# Altium schematic sheet control.SchDoc
size A3
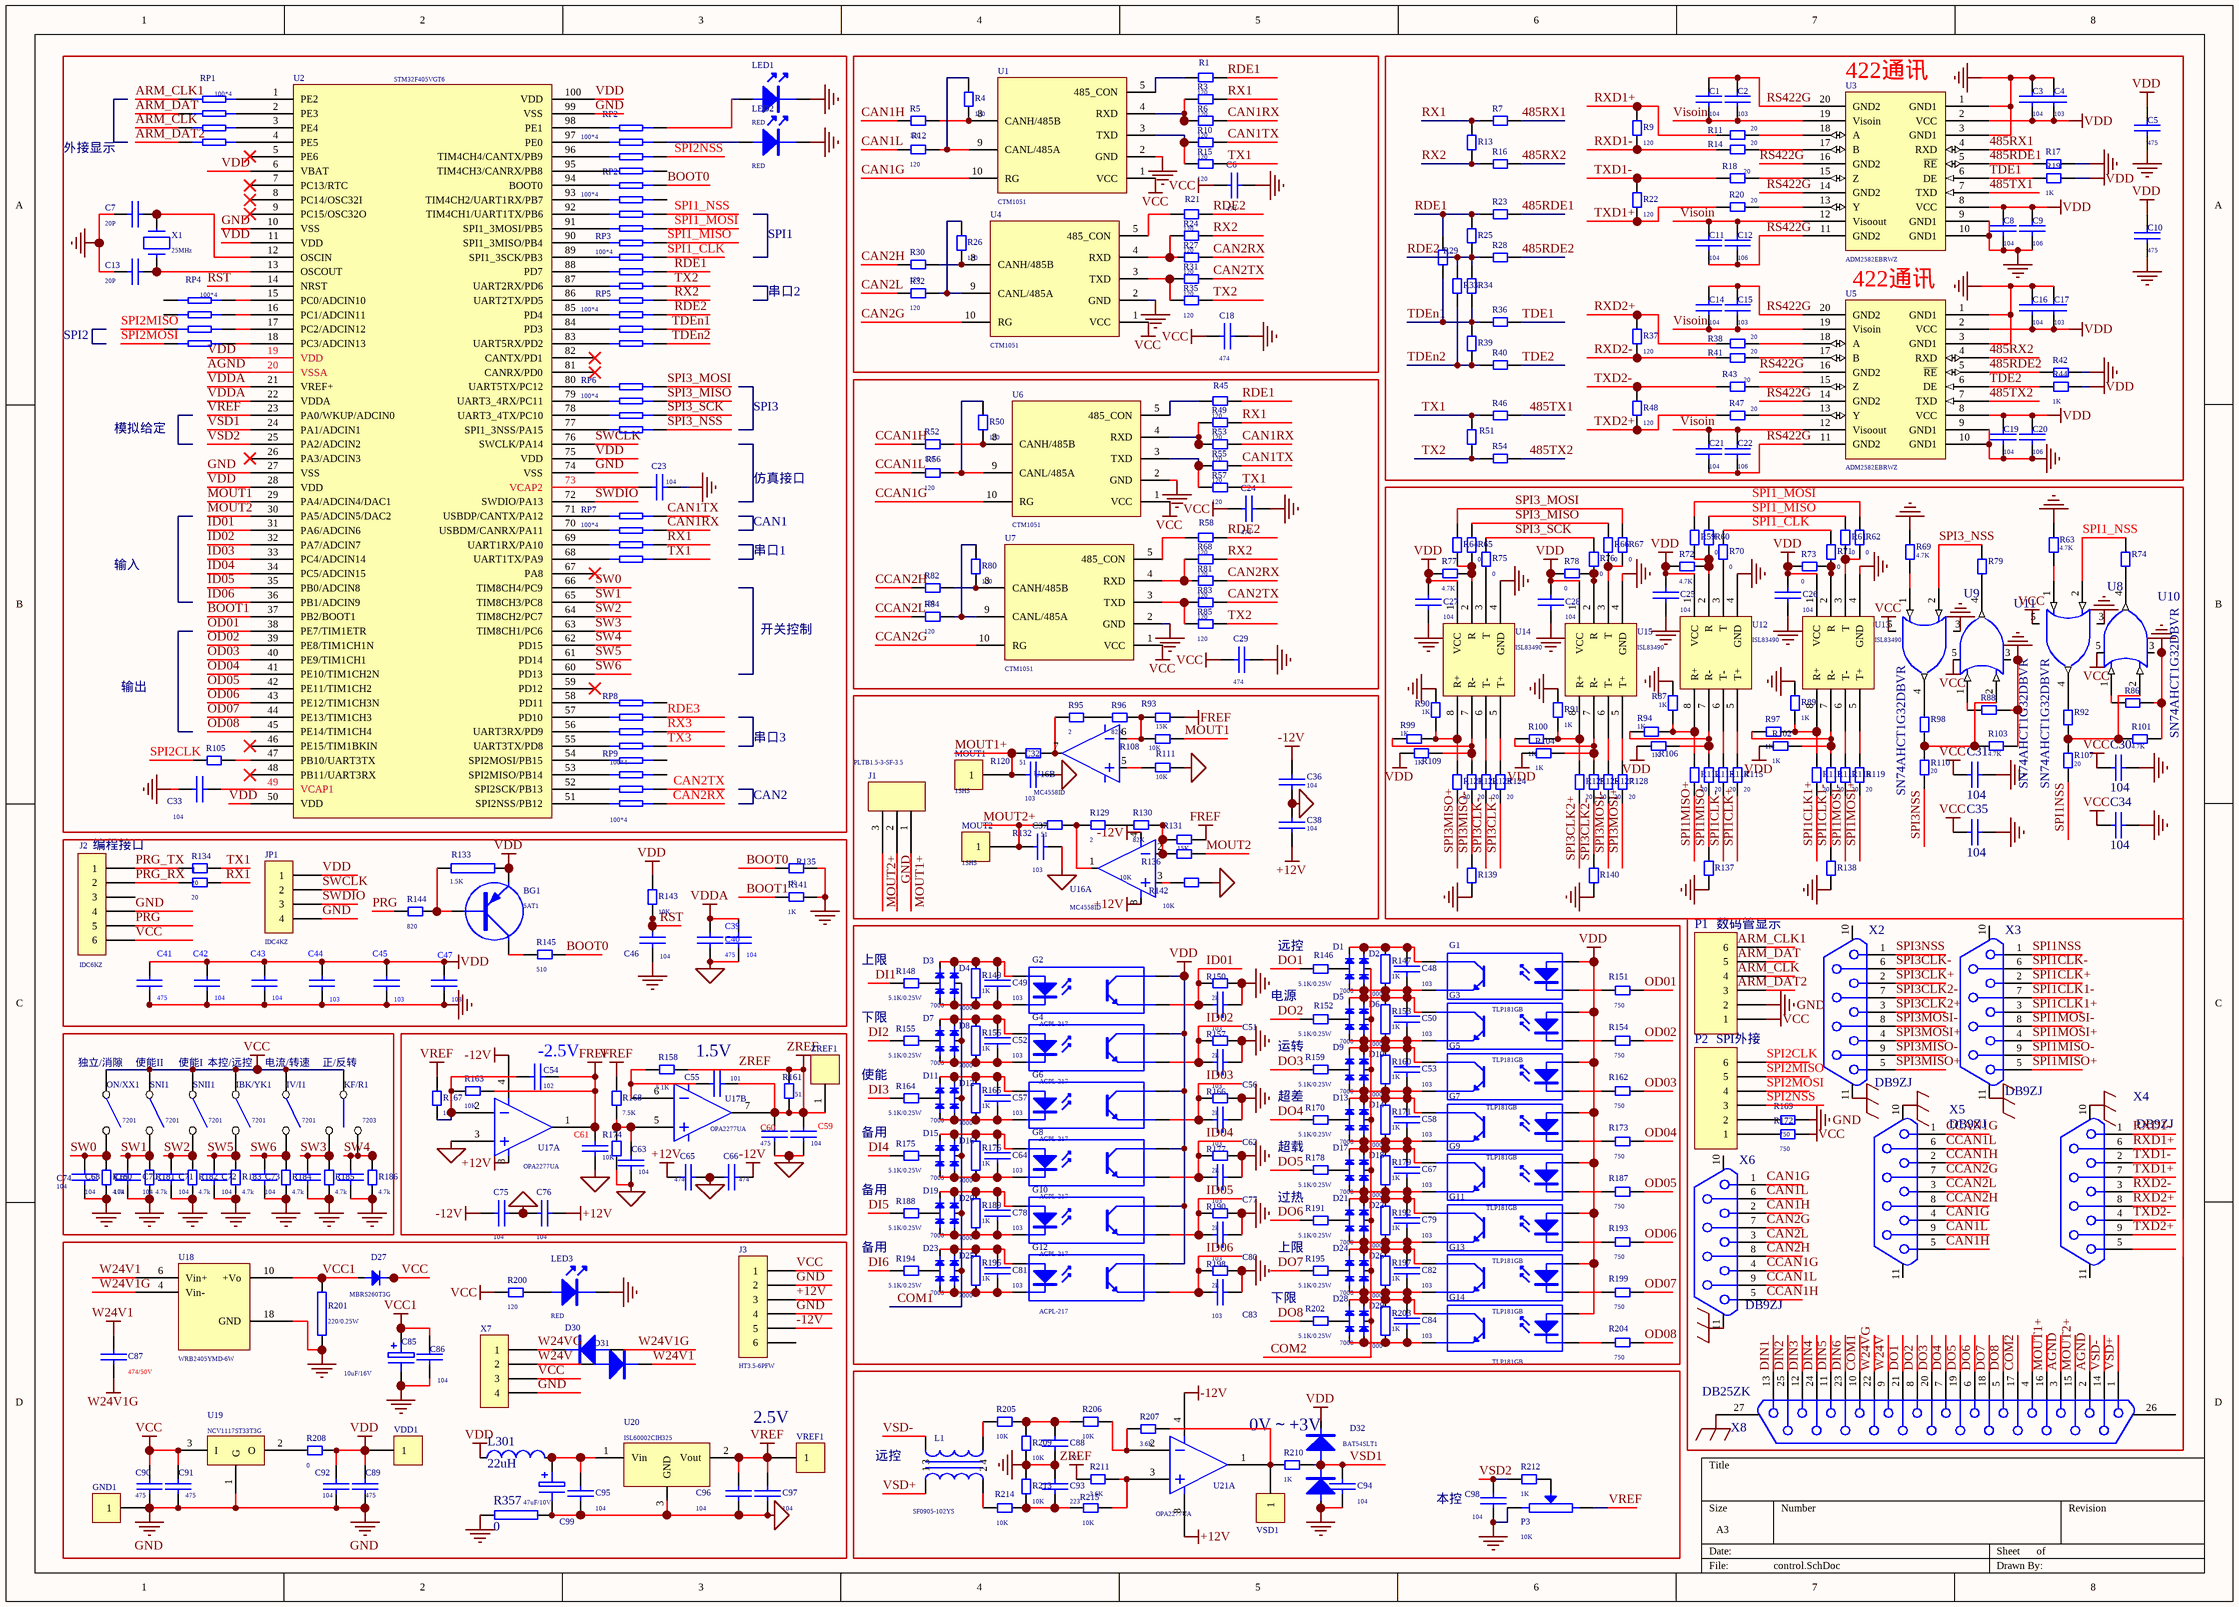
[diagram p0: control.SchDoc]

## Parts
(Parts that share a designator on the sheet are numbered #1, #2 ... from top to bottom, then left to right.)
1  20  [0603S]
BG1  5AT1  [SOT-23NP]
C1  104  [C0603S]
C2  103  [C0603S]
C3  104  [C0603S]
C4  103  [C0603S]
C5  475  [C0805S]
C6  474  [C0603S]
C7  20P  [C0603S]
C8  104  [C0603S]
C9  106  [C0805S]
C10  475  [C0805S]
C11  104  [C0603S]
C12  106  [C0805S]
C13  20P  [C0603S]
C14  104  [C0603S]
C15  103  [C0603S]
C16  104  [C0603S]
C17  103  [C0603S]
C18  474  [C0603S]
C19  104  [C0603S]
C20  106  [C0805S]
C21  104  [C0603S]
C22  106  [C0805S]
C23  104  [C0603S]
C24  474  [C0603S]
C25  104  [C0603]
C26  104  [C0603]
C27  104  [C0603]
C28  104  [C0603]
C29  474  [C0603S]
C30  104  [C0603]
C31  104  [C0603]
C32  103  [C0805]
C33  104  [C0603S]
C34  104  [C0603]
C35  104  [C0603]
C36  104  [C0805]
C37  103  [C0805]
C38  104  [C0805]
C39  104  [C0603S]
C40  475  [C0805S]
C41  475  [C0805S]
C42  104  [C0603S]
C43  104  [C0603S]
C44  103  [C0603S]
C45  103  [C0603S]
C46  104  [C0603S]
C47  103  [C0603S]
C48  103  [C0603S]
C49  103  [C0603S]
C50  103  [C0603S]
C51  103  [C0603S]
C52  103  [C0603S]
C53  103  [C0603S]
C54  102  [C0805]
C55  101  [C0805]
C56  103  [C0603S]
C57  103  [C0603S]
C58  103  [C0603S]
C59  104  [C0805]
C60  475  [C0805]
C61  (no value)  [C0805]
C62  103  [C0603S]
C63  104  [C0805]
C64  103  [C0603S]
C65  474  [C0805]
C66  474  [C0805]
C67  103  [C0603S]
C68  104  [C0805]
C69  104  [C0805]
C70  104  [C0805]
C71  104  [C0805]
C72  104  [C0805]
C73  104  [C0805]
C74  104  [C0805]
C75  104  [C0805]
C76  104  [C0805]
C77  103  [C0603S]
C78  103  [C0603S]
C79  103  [C0603S]
C80  103  [C0603S]
C81  103  [C0603S]
C82  103  [C0603S]
C83  103  [C0603S]
C84  103  [C0603S]
C85  10uF/16V  [3216T]
C86  104  [C0805]
C87  474/50V  [C0805S]
C88  223  [C0805]
C89  475  [C0805]
C90  475  [C0805]
C91  475  [C0805]
C92  104  [C0805]
C93  223  [C0805]
C94  104  [C0805]
C95  104  [C0805]
C96  104  [C0805]
C97  104  [C0805]
C98  104  [C0805]
C99  47uF/10V  [3528T]
D1  7000  [SOT-23]
D2  7000  [SOT-23]
D3  7000  [SOT-23]
D4  7000  [SOT-23]
D5  7000  [SOT-23]
D6  7000  [SOT-23]
D7  7000  [SOT-23]
D8  7000  [SOT-23]
D9  7000  [SOT-23]
D10  7000  [SOT-23]
D11  7000  [SOT-23]
D12  7000  [SOT-23]
D13  7000  [SOT-23]
D14  7000  [SOT-23]
D15  7000  [SOT-23]
D16  7000  [SOT-23]
D17  7000  [SOT-23]
D18  7000  [SOT-23]
D19  7000  [SOT-23]
D20  7000  [SOT-23]
D21  7000  [SOT-23]
D22  7000  [SOT-23]
D23  7000  [SOT-23]
D24  7000  [SOT-23]
D25  7000  [SOT-23]
D26  7000  [SOT-23]
D27  MBRS260T3G  [SMB]
D28  7000  [SOT-23]
D29  7000  [SOT-23]
D30  (no value)  [SMB]
D31  (no value)  [SMB]
D32  BAT54SLT1  [SOT-23]
G1  TLP181GB  [SO-4]
G2  ACPL-217  [SO-4S]
G3  TLP181GB  [SO-4]
G4  ACPL-217  [SO-4S]
G5  TLP181GB  [SO-4]
G6  ACPL-217  [SO-4S]
G7  TLP181GB  [SO-4]
G8  ACPL-217  [SO-4S]
G9  TLP181GB  [SO-4]
G10  ACPL-217  [SO-4S]
G11  TLP181GB  [SO-4]
G12  ACPL-217  [SO-4S]
G13  TLP181GB  [SO-4]
G14  TLP181GB  [SO-4]
GND1  (no value)  [TP]
IBK/YK1  7201  [7201]
IV/I1  7201  [7201]
J1  PLTB1.5-3-SF-3.5  [HT3.5-3PFL]
J2  IDC6KZ  [SIP6]
J3  HT3.5-6PFW  [HT3.5-6PFW]
JP1  IDC4KZ  [IDC4]
KF/R1  7203  [7203]
L1  SF0905-102YS  [SF0905]
L301  22uH  [1230]
LED1  RED  [LED0805]
LED2  RED  [LED0805]
LED3  RED  [LED0805]
MOUT1  1SHS  [CONS]
MOUT2  1SHS  [CONS]
ON/XX1  7201  [7201]
P1  数码管显示  [HDR1X6]
P2  SPI外接  [HDR1X6]
P3  10K  [SOTW19]
R1  120  [0805S]
R3  120  [0805S]
R4  120  [0805S]
R5  120  [0805S]
R6  120  [0805S]
R7  (no value)  [0603S]
R9  120  [0805S]
R10  120  [0805S]
R11  20  [0603S]
R12  120  [0805S]
R13  (no value)  [0603S]
R14  20  [0603S]
R15  120  [0805S]
R16  (no value)  [0603S]
R17  (no value)  [0603S]
R18  20  [0603S]
R19  1K  [0603S]
R20  20  [0603S]
R21  120  [0805S]
R22  120  [0805S]
R23  (no value)  [0603S]
R24  120  [0805S]
R25  (no value)  [0603S]
R26  120  [0805S]
R27  120  [0805S]
R28  (no value)  [0603S]
R29  (no value)  [0603S]
R30  120  [0805S]
R31  120  [0805S]
R32  120  [0805S]
R33  (no value)  [0603S]
R34  (no value)  [0603S]
R35  120  [0805S]
R36  (no value)  [0603S]
R37  120  [0805S]
R38  20  [0603S]
R39  (no value)  [0603S]
R40  (no value)  [0603S]
R41  20  [0603S]
R42  (no value)  [0603S]
R43  20  [0603S]
R44  1K  [0603S]
R45  120  [0805S]
R46  (no value)  [0603S]
R47  20  [0603S]
R48  120  [0805S]
R49  120  [0805S]
R50  120  [0805S]
R51  (no value)  [0603S]
R52  120  [0805S]
R53  120  [0805S]
R54  (no value)  [0603S]
R55  120  [0805S]
R56  120  [0805S]
R57  120  [0805S]
R58  120  [0805S]
R59  (no value)  [0603S]
R60  0  [0603S]
R61  0  [0603S]
R62  0  [0603S]
R63  4.7K  [0603S]
R64  (no value)  [0603S]
R65  0  [0603S]
R66  0  [0603S]
R67  0  [0603S]
R68  120  [0805S]
R69  4.7K  [0603S]
R70  0  [0603S]
R71  0  [0603S]
R72  4.7K  [0603S]
R73  0  [0603S]
R74  (no value)  [0603S]
R75  0  [0603S]
R76  0  [0603S]
R77  4.7K  [0603S]
R78  0  [0603S]
R79  (no value)  [0603S]
R80  120  [0805S]
R81  120  [0805S]
R82  120  [0805S]
R83  120  [0805S]
R84  120  [0805S]
R85  120  [0805S]
R86  (no value)  [0603S]
R87  1K  [0603S]
R88  (no value)  [0603S]
R89  1K  [0603S]
R90  1K  [0603S]
R91  1K  [0603S]
R92  (no value)  [0603S]
R93  15K  [0805S]
R94  1K  [0603S]
R95  2  [0805S]
R96  82K  [0805S]
R97  1K  [0603S]
R98  (no value)  [0603S]
R99  1K  [0603S]
R100  1K  [0603S]
R101  4.7K  [0603S]
R102  1K  [0603S]
R103  4.7K  [0603S]
R104  1K  [0603S]
R105  (no value)  [0603S]
R106  1K  [0603S]
R107  20  [0603S]
R108  10K  [0805S]
R109  1K  [0603S]
R110  20  [0603S]
R111  10K  [0805S]
R112  20  [0603S]
R113  20  [0603S]
R114  20  [0603S]
R115  20  [0603S]
R116  20  [0603S]
R117  20  [0603S]
R118  20  [0603S]
R119  20  [0603S]
R120  51  [0805S]
R121  20  [0603S]
R122  20  [0603S]
R123  20  [0603S]
R124  20  [0603S]
R125  20  [0603S]
R126  20  [0603S]
R127  20  [0603S]
R128  20  [0603S]
R129  2  [0805S]
R130  82K  [0805S]
R131  15K  [0805S]
R132  51  [0805S]
R133  1.5K  [0603S]
R134  20  [0603S]
R135  1K  [0603S]
R136  10K  [0805S]
R137  (no value)  [0603S]
R138  (no value)  [0603S]
R139  (no value)  [0603S]
R140  (no value)  [0603S]
R141  1K  [0603S]
R142  10K  [0805S]
R143  10K  [0603S]
R144  820  [0603S]
R145  510  [0603S]
R146  5.1K/0.25W  [1206S]
R147  1K  [0603S]
R148  5.1K/0.25W  [1206S]
R149  1K  [0603S]
R150  2k  [0603S]
R151  750  [0603S]
R152  5.1K/0.25W  [1206S]
R153  1K  [0603S]
R154  750  [0603S]
R155  5.1K/0.25W  [1206S]
R156  1K  [0603S]
R157  2k  [0603S]
R158  5.1K  [0603S]
R159  5.1K/0.25W  [1206S]
R160  1K  [0603S]
R161  51  [0603S]
R162  750  [0603S]
R163  10K  [0603S]
R164  5.1K/0.25W  [1206S]
R165  1K  [0603S]
R166  2k  [0603S]
R167  10K  [0603S]
R168  7.5K  [0603S]
R169  750  [0603S]
R170  5.1K/0.25W  [1206S]
R171  1K  [0603S]
R172  750  [0603S]
R173  750  [0603S]
R174  10K  [0603S]
R175  5.1K/0.25W  [1206S]
R176  1K  [0603S]
R177  2k  [0603S]
R178  5.1K/0.25W  [1206S]
R179  1K  [0603S]
R180  4.7k  [0805S]
R181  4.7k  [0805S]
R182  4.7k  [0805S]
R183  4.7k  [0805S]
R184  4.7k  [0805S]
R185  4.7k  [0805S]
R186  4.7k  [0805S]
R187  750  [0603S]
R188  5.1K/0.25W  [1206S]
R189  1K  [0603S]
R190  2k  [0603S]
R191  5.1K/0.25W  [1206S]
R192  1K  [0603S]
R193  750  [0603S]
R194  5.1K/0.25W  [1206S]
R195  5.1K/0.25W  [1206S]
R196  1K  [0603S]
R197  1K  [0603S]
R198  2k  [0603S]
R199  750  [0603S]
R200  120  [0805S]
R201  220/0.25W  [1206]
R202  5.1K/0.25W  [1206S]
R203  1K  [0603S]
R204  750  [0603S]
R205  10K  [0603S]
R206  10K  [0603S]
R207  3.6K  [0603S]
R208  0  [0603S]
R209  10K  [0603S]
R210  1K  [0603S]
R211  3.6K  [0603S]
R212  1K  [0603S]
R213  10K  [0603S]
R214  10K  [0603S]
R215  10K  [0603S]
R357  0  [0603S]
RP1  100*4  [RP4-0603]
RP2#1  100*4  [RP4-0603]
RP2#2  100*4  [RP4-0603]
RP3  100*4  [RP4-0603]
RP4  100*4  [RP4-0603]
RP5  100*4  [RP4-0603]
RP6  100*4  [RP4-0603]
RP7  100*4  [RP4-0603]
RP8  100*4  [RP4-0603]
RP9  100*4  [RP4-0603]
SNI1  7201  [7201]
SNII1  7201  [7201]
U1  CTM1051  [RSM485]
U2  STM32F405VGT6  [TQ100]
U3  ADM2582EBRWZ  [SO-20-1]
U4  CTM1051  [RSM485]
U5  ADM2582EBRWZ  [SO-20-1]
U6  CTM1051  [RSM485]
U7  CTM1051  [RSM485]
U8  SN74AHCT1G32DBVR  [SOP-5]
U9  SN74AHCT1G32DBVR  [SOP-5]
U10  SN74AHCT1G32DBVR  [SOP-5]
U11  SN74AHCT1G32DBVR  [SOP-5]
U12  ISL83490  [SO-8]
U13  ISL83490  [SO-8]
U14  ISL83490  [SO-8]
U15  ISL83490  [SO-8]
U16  MC4558ID  [SO-8]  (parts A,B of 2)
U17  OPA2277UA  [SO-8]  (parts A,B of 2)
U18  WRB2405YMD-6W  [WRB2405]
U19  NCV1117ST33T3G  [SOT-223]
U20  ISL60002CIH325  [SOT-23]
U21  OPA2277UA  [SO-8]  (part A of 2)
VDD1  (no value)  [TP]
VREF1  (no value)  [TP]
VSD1  (no value)  [CONS]
X1  25MHz  [TXAL1]
X2  DB9ZJ  [DB9MS]
X3  DB9ZJ  [DB9MS]
X4  DB9ZJ  [DB9MS]
X5  DB9ZJ  [DB9MS]
X6  DB9ZJ  [DB9MS]
X7  (no value)  [HT5.08-4P]
X8  DB25ZK  [DB25RA/FJ]
ZREF1  (no value)  [TP]

## Blocks framed on the sheet
编程接口: 1 BG1 C39-C47 J2 JP1 R133-R135 R141 R143-R145
2.5V: C85-C87 C89-C92 C95-C97 C99 D27 D30 D31 GND1 J3 L301 LED3 R200 R201 R208 R357 U18-U20 VDD1 VREF1 X7
0V～+3V: C88 C93 C94 C98 D32 L1 P3 R205-R207 R209-R215 U21 VSD1

## Nets
+12V: C38.1 C65.1 C76.1 J3.3 U16.8 U17.8 U21.8
-12V: C36.2 C66.2 C75.2 J3.5 U16.4 U17.4 U21.4
AGND: C32.1 C36.1 C37.2 C38.2 C39.1 C40.1 C59.2 C60.2 C61.1 C63.1 C65.2 C66.1 C75.1 C76.2 C95.2 C96.2 C97.1 C99.2 R111.2 R142.2 R174.1 R357.1 U2.20(VSSA) U17.3 U20.3(GND) X8.2 X8.3
FREF: C54.1 C61.2 R93.2 R131.2 R163.2 U17.1
GND: C3.1 C4.2 C5.1 C6.2 C7.1 C8.2 C9.1 C10.1 C13.1 C16.1 C17.2 C18.1 C19.2 C20.1 C23.1 C24.2 C25.2 C26.2 C27.2 C28.2 C29.1 C30.2 C31.2 C33.1 C34.2 C35.2 C41.2 C42.1 C43.1 C44.1 C45.1 C46.1 C47.1 C51.1 C56.1 C62.1 C68.2 C69.2 C70.2 C71.2 C72.2 C73.2 C74.2 C77.1 C80.1 C83.1 C85.2 C86.2 C88.1 C89.2 C90.2 C91.2 C92.2 C93.1 C94.1 C98.2 D32.1 GND1.1 J1.2 J2.4 J3.2 J3.4 JP1.4 LED1.K LED2.K LED3.K P1.2 P3.2 R17.1 R42.1 R63.2 R69.2 R86.2 R87.2 R88.2 R89.2 R90.2 R91.2 R101.2 R103.2 R135.2 R137.2 R138.2 R139.2 R140.2 R141.2 R150.2 R157.2 R166.2 R177.2 R180.1 R181.1 R182.1 R183.1 R184.1 R185.1 R186.1 R190.2 R198.2 R201.1 R209.1 R213.2 R357.2 U1.2(GND) U2.10(VSS) U2.27(VSS) U2.74(VSS) U2.99(VSS) U3.1(GND1) U3.3(GND1) U3.9(GND1) U3.10(GND1) U4.2(GND) U5.1(GND1) U5.3(GND1) U5.9(GND1) U5.10(GND1) U6.2(GND) U7.2(GND) U8.3(GND) U9.3(GND) U10.3(GND) U11.3(GND) U12.4(GND) U13.4(GND) U14.4(GND) U15.4(GND) U18.18(GND) U19.1(G) X7.4
PE: X2.11 X3.11 X4.10 X5.10 X6.11 X8.27
VCC: C6.1 C18.2 C24.1 C29.2 C30.1 C31.1 C34.1 C35.1 C90.1 C91.1 D27.K IBK/YK1.1(COMMON) IV/I1.1(COMMON) J2.6 J3.1 KF/R1.1 ON/XX1.1(COMMON) P1.1 R200.1 SNI1.1(COMMON) SNII1.1(COMMON) U1.1(VCC) U4.1(VCC) U6.1(VCC) U7.1(VCC) U8.5(VCC) U9.5(VCC) U10.5(VCC) U11.5(VCC) U19.3(I) X7.3
VCC1: C85.1 C86.1 D27.A R201.2 U18.10(+Vo)
VDD: BG1.E C3.2 C4.1 C5.2 C8.1 C9.2 C10.2 C16.2 C17.1 C19.1 C20.2 C25.1 C26.1 C27.1 C28.1 C41.1 C42.2 C43.2 C44.2 C45.2 C47.2 C89.1 C92.1 D32.2 G1.1 G2.4 G3.1 G4.4 G5.1 G6.4 G7.1 G8.4 G9.1 G10.4 G11.1 G12.4 G13.1 G14.1 JP1.1 L301.2 R19.1 R44.1 R72.2 R73.1 R77.2 R78.1 R102.2 R104.2 R106.2 R109.2 R133.2 R143.2 R208.2 U2.6(VBAT) U2.11(VDD) U2.19(VDD) U2.28(VDD) U2.50(VDD) U2.75(VDD) U2.100(VDD) U3.2(VCC) U3.8(VCC) U5.2(VCC) U5.8(VCC) U12.1(VCC) U13.1(VCC) U14.1(VCC) U15.1(VCC) VDD1.1
VDDA: C39.2 C40.2 U2.21(VREF+) U2.22(VDDA)
VREF: C96.1 C97.2 P3.1 R167.2 R168.2 U2.23(PA0/WKUP/ADCIN0) U20.2(Vout) VREF1.1
W24V1: C87.1 D31.K U18.6(Vin+)
W24V1G: C87.2 D30.A U18.4(Vin-)
ZREF: C55.2 C59.1 C60.1 R158.2 R161.1 R161.2 R211.2 U17.7 ZREF1.1
485RDE1: R17.2 R23.2 U3.5(~{RE})
485RDE2: R28.2 R42.2 U5.5(~{RE})
485RX1: R7.2 U3.4(RXD)
485RX2: R16.2 U5.4(RXD)
485TX1: R46.2 U3.7(TXD)
485TX2: R54.2 U5.7(TXD)
ARM_CLK: RP1.3
ARM_CLK1: RP1.1
ARM_DAT: RP1.2
ARM_DAT2: RP1.4
BOOT0: R135.1 R145.2 RP2#2.8
BOOT1: R141.1 U2.37(PB2/BOOT1)
CAN1G: U1.10(RG) X5.4 X6.1
CAN1H: R5.1 X5.5 X6.2
CAN1L: R12.1 X5.9 X6.6
CAN1RX: R6.2 R53.2 RP7.7
CAN1TX: R10.2 R55.2 RP7.8
CAN2G: U4.10(RG) X6.7
CAN2H: R30.1 X6.8
CAN2L: R32.1 X6.3
CAN2RX: R27.2 R81.2 RP9.5
CAN2TX: R31.2 R83.2 RP9.6
CCAN1G: U6.10(RG) X5.1 X6.4
CCAN1H: R52.1 X5.2 X6.5
CCAN1L: R56.1 X5.6 X6.9
CCAN2G: U7.10(RG) X5.7
CCAN2H: R82.1 X5.8
CCAN2L: R84.1 X5.3
COM1: D4.3 D8.3 D12.3 D16.3 D20.3 D25.3 X8.10
COM2: D2.3 D6.3 D10.3 D14.3 D18.3 D22.3 D26.3 D29.3 X8.17
DI1: R148.1
DI2: R155.1
DI3: R164.1
DI4: R175.1
DI5: R188.1
DI6: R194.1
DIN1: X8.13
DIN2: X8.25
DIN3: X8.12
DIN4: X8.24
DIN5: X8.11
DIN6: X8.23
DO1: R146.1 X8.21
DO2: R152.1 X8.8
DO3: R159.1 X8.20
DO4: R170.1 X8.7
DO5: R178.1 X8.19
DO6: R191.1 X8.6
DO7: R195.1 X8.18
DO8: R202.1 X8.5
ID01: C51.2 G2.3 R150.1 U2.31(PA6/ADCIN6)
ID02: C56.2 G4.3 R157.1 U2.32(PA7/ADCIN7)
ID03: C62.2 G6.3 R166.1 U2.33(PC4/ADCIN14)
ID04: C77.2 G8.3 R177.1 U2.34(PC5/ADCIN15)
ID05: C80.2 G10.3 R190.1 U2.35(PB0/ADCIN8)
ID06: C83.2 G12.3 R198.1 U2.36(PB1/ADCIN9)
MOUT1: R108.2 U2.29(PA4/ADCIN4/DAC1)
MOUT1+: C32.2 J1.1 MOUT1.1 R120.1 X8.16
MOUT2: R136.2 U2.30(PA5/ADCIN5/DAC2)
MOUT2+: C37.1 J1.3 MOUT2.1 R132.1 X8.15
OD01: R151.2 U2.38(PE7/TIM1ETR)
OD02: R154.2 U2.39(PE8/TIM1CH1N)
OD03: R162.2 U2.40(PE9/TIM1CH1)
OD04: R173.2 U2.41(PE10/TIM1CH2N)
OD05: R187.2 U2.42(PE11/TIM1CH2)
OD06: R193.2 U2.43(PE12/TIM1CH3N)
OD07: R199.2 U2.44(PE13/TIM1CH3)
OD08: R204.2 U2.45(PE14/TIM1CH4)
PRG: J2.5 R144.1
PRG_RX: 1.1 J2.2
PRG_TX: J2.1 R134.1
RDE1: R1.2 R23.1 R25.2 R29.2 R45.2 RP3.6
RDE2: R21.2 R25.1 R28.1 R33.2 R34.2 R58.2 RP5.7
RDE3: RP8.7
RS422G: C1.1 C2.2 C11.2 C12.1 C14.1 C15.2 C21.2 C22.1 U3.11(GND2) U3.14(GND2) U3.16(GND2) U3.20(GND2) U5.11(GND2) U5.14(GND2) U5.16(GND2) U5.20(GND2)
RST: C46.2 R143.1 U2.14(NRST)
RX1: 1.2 R3.2 R7.1 R13.2 R49.2 RP7.6
RX2: R13.1 R16.1 R24.2 R68.2 RP5.8
RX3: RP8.6
RXD1+: R9.1 R11.1 X4.6
RXD1-: R9.2 R14.1 X4.1
RXD2+: R37.1 R38.1 X4.8
RXD2-: R37.2 R41.1 X4.3
SPI1_CLK: R70.1 R71.2 RP3.7
SPI1_MISO: R60.1 R61.1 RP3.8
SPI1_MOSI: R59.1 R62.1 RP2#2.5
SPI1_NSS: R74.2 RP2#2.6 U8.2
SPI1CLK1+: R116.1 X3.3
SPI1CLK1-: R117.1 R138.1 X3.7
SPI1CLK+: R115.1 X3.2
SPI1CLK-: R114.1 X3.6
SPI1MISO+: R112.1 X3.5
SPI1MISO-: R113.1 R137.1 X3.9
SPI1MOSI+: R119.1 X3.4
SPI1MOSI-: R118.1 X3.8
SPI1NSS: R107.1 X3.1
SPI2CLK: P2.6 R105.1
SPI2MISO: P2.5 RP4.3
SPI2MOSI: P2.4 RP4.4
SPI2NSS: P2.3 RP2#1.6
SPI3_MISO: R65.1 R66.1 RP6.7
SPI3_MOSI: R64.1 R67.1 RP6.8
SPI3_NSS: R79.2 RP6.5 U9.2
SPI3_SCK: R75.1 R76.2 RP6.6
SPI3CLK2+: R125.1 X2.3
SPI3CLK2-: X2.7
SPI3CLK+: R124.1 X2.2
SPI3CLK-: R123.1 X2.6
SPI3MISO+: R121.1 X2.5
SPI3MISO-: R122.1 R139.1 X2.9
SPI3MOSI+: R128.1 X2.4
SPI3MOSI-: R127.1 X2.8
SPI3NSS: R110.1 X2.1
SW0: C74.1 ON/XX1.2(NO) R180.2 U2.66(TIM8CH4/PC9)
SW1: C68.1 R181.2 SNI1.2(NO) U2.65(TIM8CH3/PC8)
SW2: C69.1 R182.2 SNII1.2(NO) U2.64(TIM8CH2/PC7)
SW3: C72.1 KF/R1.2 R185.2 U2.63(TIM8CH1/PC6)
SW4: C73.1 KF/R1.3 R186.2 U2.62(PD15)
SW5: C70.1 IBK/YK1.2(NO) R183.2 U2.61(PD14)
SW6: C71.1 IV/I1.2(NO) R184.2 U2.60(PD13)
SWCLK: JP1.2 U2.76(SWCLK/PA14)
SWDIO: JP1.3 U2.72(SWDIO/PA13)
TDE1: R19.2 R36.2 U3.6(DE)
TDE2: R40.2 R44.2 U5.6(DE)
TDEn1: R29.1 R34.1 R36.1 R39.2 RP5.6
TDEn2: R33.1 R39.1 R40.1 RP5.5
TX1: R15.2 R46.1 R51.2 R57.2 R134.2 RP7.5
TX2: R35.2 R51.1 R54.1 R85.2 RP3.5
TX3: RP8.5
TXD1+: R20.1 R22.2 X4.7
TXD1-: R18.1 R22.1 X4.2
TXD2+: R47.1 R48.2 X4.9
TXD2-: R43.1 R48.1 X4.4
Visoin: C1.2 C2.1 C11.1 C12.2 C14.2 C15.1 C21.1 C22.2 U3.12(Visoout) U3.19(Visoin) U5.12(Visoout) U5.19(Visoin)
VSD1: C94.2 D32.3 R210.2 U2.24(PA1/ADCIN1)
VSD2: C98.1 R212.1 U2.25(PA2/ADCIN2)
VSD+: L1.1 X8.1
VSD-: L1.3 X8.14
W24V: D31.A X7.2 X8.9
W24VG: D30.K X7.1 X8.22
NetBG1_B: BG1.B R133.1 R144.2
NetBG1_C: BG1.C R145.1
NetC7_2: C7.2 U2.12(OSCIN) X1.2
NetC13_2: C13.2 U2.13(OSCOUT) X1.1
NetC23_2: C23.2 U2.73(VCAP2)
NetC33_2: C33.2 U2.49(VCAP1)
NetC48_1: C48.1 D1.1 D2.1 G1.3 R147.2
NetC48_2: C48.2 D1.2 D2.2 G1.4 R147.1
NetC49_1: C49.1 D3.1 D4.1 G2.2 R149.2
NetC49_2: C49.2 D3.2 D4.2 G2.1 R149.1
NetC50_1: C50.1 D5.1 D6.1 G3.3 R153.2
NetC50_2: C50.2 D5.2 D6.2 G3.4 R153.1
NetC52_1: C52.1 D7.1 D8.1 G4.2 R156.2
NetC52_2: C52.2 D7.2 D8.2 G4.1 R156.1
NetC53_1: C53.1 D9.1 D10.1 G5.3 R160.2
NetC53_2: C53.2 D9.2 D10.2 G5.4 R160.1
NetC54_2: C54.2 R163.1 R167.1 U17.2
NetC55_1: C55.1 R158.1 U17.6
NetC57_1: C57.1 D11.1 D12.1 G6.2 R165.2
NetC57_2: C57.2 D11.2 D12.2 G6.1 R165.1
NetC58_1: C58.1 D13.1 D14.1 G7.3 R171.2
NetC58_2: C58.2 D13.2 D14.2 G7.4 R171.1
NetC63_2: C63.2 R168.1 R174.2 U17.5
NetC64_1: C64.1 D15.1 D16.1 G8.2 R176.2
NetC64_2: C64.2 D15.2 D16.2 G8.1 R176.1
NetC67_1: C67.1 D17.1 D18.1 G9.3 R179.2
NetC67_2: C67.2 D17.2 D18.2 G9.4 R179.1
NetC78_1: C78.1 D19.1 D20.1 G10.2 R189.2
NetC78_2: C78.2 D19.2 D20.2 G10.1 R189.1
NetC79_1: C79.1 D21.1 D22.1 G11.3 R192.2
NetC79_2: C79.2 D21.2 D22.2 G11.4 R192.1
NetC81_1: C81.1 D23.1 D25.1 G12.2 R196.2
NetC81_2: C81.2 D23.2 D25.2 G12.1 R196.1
NetC82_1: C82.1 D24.1 D26.1 G13.3 R197.2
NetC82_2: C82.2 D24.2 D26.2 G13.4 R197.1
NetC84_1: C84.1 D28.1 D29.1 G14.3 R203.2
NetC84_2: C84.2 D28.2 D29.2 G14.4 R203.1
NetC88_2: C88.2 R205.2 R206.1 R209.2
NetC93_2: C93.2 R213.1 R214.2 R215.1
NetC95_1: C95.1 C99.1 L301.1 U20.1(Vin)
NetD1_3: D1.3 R146.2
NetD3_3: D3.3 R148.2
NetD5_3: D5.3 R152.2
NetD7_3: D7.3 R155.2
NetD9_3: D9.3 R159.2
NetD11_3: D11.3 R164.2
NetD13_3: D13.3 R170.2
NetD15_3: D15.3 R175.2
NetD17_3: D17.3 R178.2
NetD19_3: D19.3 R188.2
NetD21_3: D21.3 R191.2
NetD23_3: D23.3 R194.2
NetD24_3: D24.3 R195.2
NetD28_3: D28.3 R202.2
NetG1_2: G1.2 R151.1
NetG3_2: G3.2 R154.1
NetG5_2: G5.2 R162.1
NetG7_2: G7.2 R173.1
NetG9_2: G9.2 R187.1
NetG11_2: G11.2 R193.1
NetG13_2: G13.2 R199.1
NetG14_2: G14.2 R204.1
NetL1_2: L1.2 R214.1
NetL1_4: L1.4 R205.1
NetLED1_A: LED1.A RP2#1.8
NetLED2_A: LED2.A RP2#1.7
NetLED3_A: LED3.A R200.2
NetP2_1: P2.1 R172.1
NetP2_2: P2.2 R169.1
NetP3_W: P3.W R212.2
NetR1_1: R1.1 U1.5(485_CON)
NetR3_1: R3.1 R6.1 U1.4(RXD)
NetR4_1: R4.1 R5.2 U1.8(CANH/485B)
NetR4_2: R4.2 R12.2 U1.9(CANL/485A)
NetR10_1: R10.1 R15.1 U1.3(TXD)
NetR11_2: R11.2 U3.18(A)
NetR14_2: R14.2 U3.17(B)
NetR18_2: R18.2 U3.15(Z)
NetR20_2: R20.2 U3.13(Y)
NetR21_1: R21.1 U4.5(485_CON)
NetR24_1: R24.1 R27.1 U4.4(RXD)
NetR26_1: R26.1 R30.2 U4.8(CANH/485B)
NetR26_2: R26.2 R32.2 U4.9(CANL/485A)
NetR31_1: R31.1 R35.1 U4.3(TXD)
NetR38_2: R38.2 U5.18(A)
NetR41_2: R41.2 U5.17(B)
NetR43_2: R43.2 U5.15(Z)
NetR45_1: R45.1 U6.5(485_CON)
NetR47_2: R47.2 U5.13(Y)
NetR49_1: R49.1 R53.1 U6.4(RXD)
NetR50_1: R50.1 R52.2 U6.8(CANH/485B)
NetR50_2: R50.2 R56.2 U6.9(CANL/485A)
NetR55_1: R55.1 R57.1 U6.3(TXD)
NetR58_1: R58.1 U7.5(485_CON)
NetR59_2: R59.2 R60.2 R72.1 U12.2(R)
NetR61_2: R61.2 R62.2 U13.3(T)
NetR63_1: R63.1 U8.1
NetR64_2: R64.2 R65.2 R77.1 U14.2(R)
NetR66_2: R66.2 R67.2 U15.3(T)
NetR68_1: R68.1 R81.1 U7.4(RXD)
NetR69_1: R69.1 U9.1
NetR70_2: R70.2 U12.3(T)
NetR71_1: R71.1 R73.2 U13.2(R)
NetR74_1: R74.1 U10.4
NetR75_2: R75.2 U14.3(T)
NetR76_1: R76.1 R78.2 U15.2(R)
NetR79_1: R79.1 U11.4
NetR80_1: R80.1 R82.2 U7.8(CANH/485B)
NetR80_2: R80.2 R84.2 U7.9(CANL/485A)
NetR83_1: R83.1 R85.1 U7.3(TXD)
NetR86_1: R86.1 U10.1
NetR87_1: R87.1 R94.1 R112.2 U12.8(R+)
NetR88_1: R88.1 U11.1
NetR89_1: R89.1 R97.1 R116.2 U13.8(R+)
NetR90_1: R90.1 R99.1 R121.2 U14.8(R+)
NetR91_1: R91.1 R100.1 R125.2 U15.8(R+)
NetR92_1: R92.1 R101.1 R107.2 U10.2
NetR92_2: R92.2 U8.4
NetR93_1: R93.1 R96.2 R108.1 U16.6
NetR94_2: R94.2 R106.1 R113.2 U12.7(R-)
NetR95_1: R95.1 R120.2 U16.7
NetR95_2: R95.2 R96.1
NetR97_2: R97.2 R102.1 R117.2 U13.7(R-)
NetR98_1: R98.1 R103.1 R110.2 U11.2
NetR98_2: R98.2 U9.4
NetR99_2: R99.2 R109.1 R122.2 U14.7(R-)
NetR100_2: R100.2 R104.1 R126.2 U15.7(R-)
NetR105_2: R105.2 U2.47(PB10/UART3TX)
NetR111_1: R111.1 U16.5
NetR114_2: R114.2 U12.6(T-)
NetR115_2: R115.2 U12.5(T+)
NetR118_2: R118.2 U13.6(T-)
NetR119_2: R119.2 U13.5(T+)
NetR123_2: R123.2 U14.6(T-)
NetR124_2: R124.2 U14.5(T+)
NetR126_1: R126.1 R140.1
NetR127_2: R127.2 U15.6(T-)
NetR128_2: R128.2 U15.5(T+)
NetR129_1: R129.1 R132.2 U16.1
NetR129_2: R129.2 R130.1
NetR130_2: R130.2 R131.1 R136.1 U16.2
NetR142_1: R142.1 U16.3
NetR206_2: R206.2 R207.1 U21.2
NetR207_2: R207.2 R210.1 U21.1 VSD1.1
NetR208_1: R208.1 U19.2(O)
NetR211_1: R211.1 R215.2 U21.3
NetRP1_5: RP1.5 U2.4(PE5)
NetRP1_6: RP1.6 U2.3(PE4)
NetRP1_7: RP1.7 U2.2(PE3)
NetRP1_8: RP1.8 U2.1(PE2)
NetRP2#1_1: RP2#1.1 U2.98(PE1)
NetRP2#1_2: RP2#1.2 U2.97(PE0)
NetRP2#1_3: RP2#1.3 U2.96(TIM4CH4/CANTX/PB9)
NetRP2#1_4: RP2#1.4 U2.95(TIM4CH3/CANRX/PB8)
NetRP2#2_1: RP2#2.1 U2.94(BOOT0)
NetRP2#2_2: RP2#2.2 U2.93(TIM4CH2/UART1RX/PB7)
NetRP2#2_3: RP2#2.3 U2.92(TIM4CH1/UART1TX/PB6)
NetRP2#2_4: RP2#2.4 U2.91(SPI1_3MOSI/PB5)
NetRP3_1: RP3.1 U2.90(SPI1_3MISO/PB4)
NetRP3_2: RP3.2 U2.89(SPI1_3SCK/PB3)
NetRP3_3: RP3.3 U2.88(PD7)
NetRP3_4: RP3.4 U2.87(UART2RX/PD6)
NetRP4_5: RP4.5 U2.18(PC3/ADCIN13)
NetRP4_6: RP4.6 U2.17(PC2/ADCIN12)
NetRP4_7: RP4.7 U2.16(PC1/ADCIN11)
NetRP4_8: RP4.8 U2.15(PC0/ADCIN10)
NetRP5_1: RP5.1 U2.86(UART2TX/PD5)
NetRP5_2: RP5.2 U2.85(PD4)
NetRP5_3: RP5.3 U2.84(PD3)
NetRP5_4: RP5.4 U2.83(UART5RX/PD2)
NetRP6_1: RP6.1 U2.80(UART5TX/PC12)
NetRP6_2: RP6.2 U2.79(UART3_4RX/PC11)
NetRP6_3: RP6.3 U2.78(UART3_4TX/PC10)
NetRP6_4: RP6.4 U2.77(SPI1_3NSS/PA15)
NetRP7_1: RP7.1 U2.71(USBDP/CANTX/PA12)
NetRP7_2: RP7.2 U2.70(USBDM/CANRX/PA11)
NetRP7_3: RP7.3 U2.69(UART1RX/PA10)
NetRP7_4: RP7.4 U2.68(UART1TX/PA9)
NetRP8_1: RP8.1 U2.58(PD11)
NetRP8_2: RP8.2 U2.57(PD10)
NetRP8_3: RP8.3 U2.56(UART3RX/PD9)
NetRP8_4: RP8.4 U2.55(UART3TX/PD8)
NetRP9_1: RP9.1 U2.54(SPI2MOSI/PB15)
NetRP9_2: RP9.2 U2.53(SPI2MISO/PB14)
NetRP9_3: RP9.3 U2.52(SPI2SCK/PB13)
NetRP9_4: RP9.4 U2.51(SPI2NSS/PB12)

Not connected (* = marked no-connect by the designer): J2 3; J3 6; P1 3 4 5 6; R169 2; R172 2; RP2#1 5; RP2#2 7; RP4 1 2; RP8 8; RP9 7 8; U2 5(PE6)* 7(PC13/RTC)* 8(PC14/OSC32I)* 9(PC15/OSC32O)* 26(PA3/ADCIN3)* 46(PE15/TIM1BKIN)* 48(PB11/UART3RX)* 59(PD12)* 67(PA8)* 81(CANRX/PD0)* 82(CANTX/PD1)*; X2 10; X3 10; X4 5 11; X5 11; X6 10; X8 4 26

## Notes on the sheet
- (near U3) 422通讯
- 外接显示
- SPI1
- SPI2
- 串口2
- 422通讯
- 模拟给定
- 仿真接口
- SPI3
- CAN1
- 输入
- 串口1
- 输出
- 开关控制
- 串口3
- CAN2
- (near R148) 上限
- (near R146) 远控
- (near C54) -2.5V
- 1.5V
- 下限
- 电源
- 运转
- (near ON/XX1) 独立/消隙
- 使能II
- 使能I
- 本控/远控
- 电流/转速
- 正/反转
- 使能
- 超差
- 备用
- 超载
- 过热
- 上限
- (near L1) 远控
- (near C98) 本控
- Labels drawn without touching a wire or pin: ARM_CLK, ARM_CLK1, ARM_DAT, ARM_DAT2, GND, SPI3CLK2-, VCC

## Library data of the parts
1 R1 R3-R7 R9-R132 R134-R200 R202-R215 = RES: 常用立式插装电阻
BG1 = PNP: Part Field 10: 1000u; Part Field 9: 500u
C1-C6 C8-C12 C14-C24 C29 C33 C46 = CAP: Capacitor
C7 C13 C25-C28 C30-C32 C34-C45 C47 C51 C54-C56 C59-C63 C65 C66 C68-C77 C80 C83 C88-C98 = CAPSMD: Capacitor SMD
C48-C50 C52 C53 C57 C58 C64 C67 C78 C79 C81 C82 C84 C87 = CAP: 常用插件电容
C85 = ECAP-L1: 小型电解电容 RB.2/.4  ( .2/.5  .25/.5  .3/.6 ); Part Field 1: 0; Part Field 10: 1000u; Part Field 2: 0; Part Field 3: 0; Part Field 4: 0; Part Field 5: 1; Part Field 6: 0; Part Field 7: 1u; Part Field 8: 1u; Part Field 9: 500u
C86 = CAP: 常用插件电容; Part Field 1: 0; Part Field 10: 1000u; Part Field 2: 0; Part Field 3: 0; Part Field 4: 0; Part Field 5: 1; Part Field 6: 0; Part Field 7: 1u; Part Field 8: 1u; Part Field 9: 500u
C99 = ECAP-SMD: 钽电解CAP(贴装)
D1-D26 D28 D29 = MMBD7000-S: 二极管阵列
D27 = DIODE_1: 开关二极管MMBD6050,MMDL6050(SOD-323),BY359
D30 D31 = DIODE-W: 卧式插装二极管
D32 = MMDB7000
G1-G14 = OPTOCOUPLER4: 光耦
GND1 MOUT1 MOUT2 VDD1 VREF1 VSD1 = CON1: Connector
IBK/YK1 IV/I1 ON/XX1 SNI1 SNII1 = SW SPST
J1 = CON3: 霍尔
J2 = CON6: 接线端子座,中点电压板
J3 = CON6: Connector
JP1 X7 = CON4: Connector,模块电源,印制板接线端子
KF/R1 = SW-SPDT
L1 = TRANS2: SMD共轭电感
L301 = INDUCTOR: 电感
LED1-LED3 = LED: LED发光二极管
P1 P2 = Header 6: Header, 6-Pin; LatestRevisionDate: 17-Jul-2002; LatestRevisionNote: Re-released for DXP Platform.; Publisher: Altium Limited
P3 = POT2: Potentiometer
R133 R201 R357 = RESSMD: 表贴电阻
RP1 RP2#1 RP2#2 RP3-RP9 = RES*4
U1 U4 U6 U7 = RSM485S_CTM8251T
U2 = STM32F103V
U3 U5 = ADM2582EBRWZ: R422隔离接口芯片
U8-U11 = SN74AHCT1G32GV: 单或非门（SOP-5）
U12-U15 = SP490E: 差分收发器
U16 = 1458
U17 U21 = 1458: Part Field 10: 1000u; Part Field 9: 500u
U18 = WRB2405DCDC: 24-5V开关电源
U19 = AS1117M3: AS1117M3-3.3V
U20 = ISL60002
X1 = CRYSTAL
X2-X6 = DB9
X8 = DB25: 25P(弯针座))
ZREF1 = 1PIN